# Altium schematic sheet MCU.SchDoc
size A3; SheetNumber: 7; SheetTotal: 10
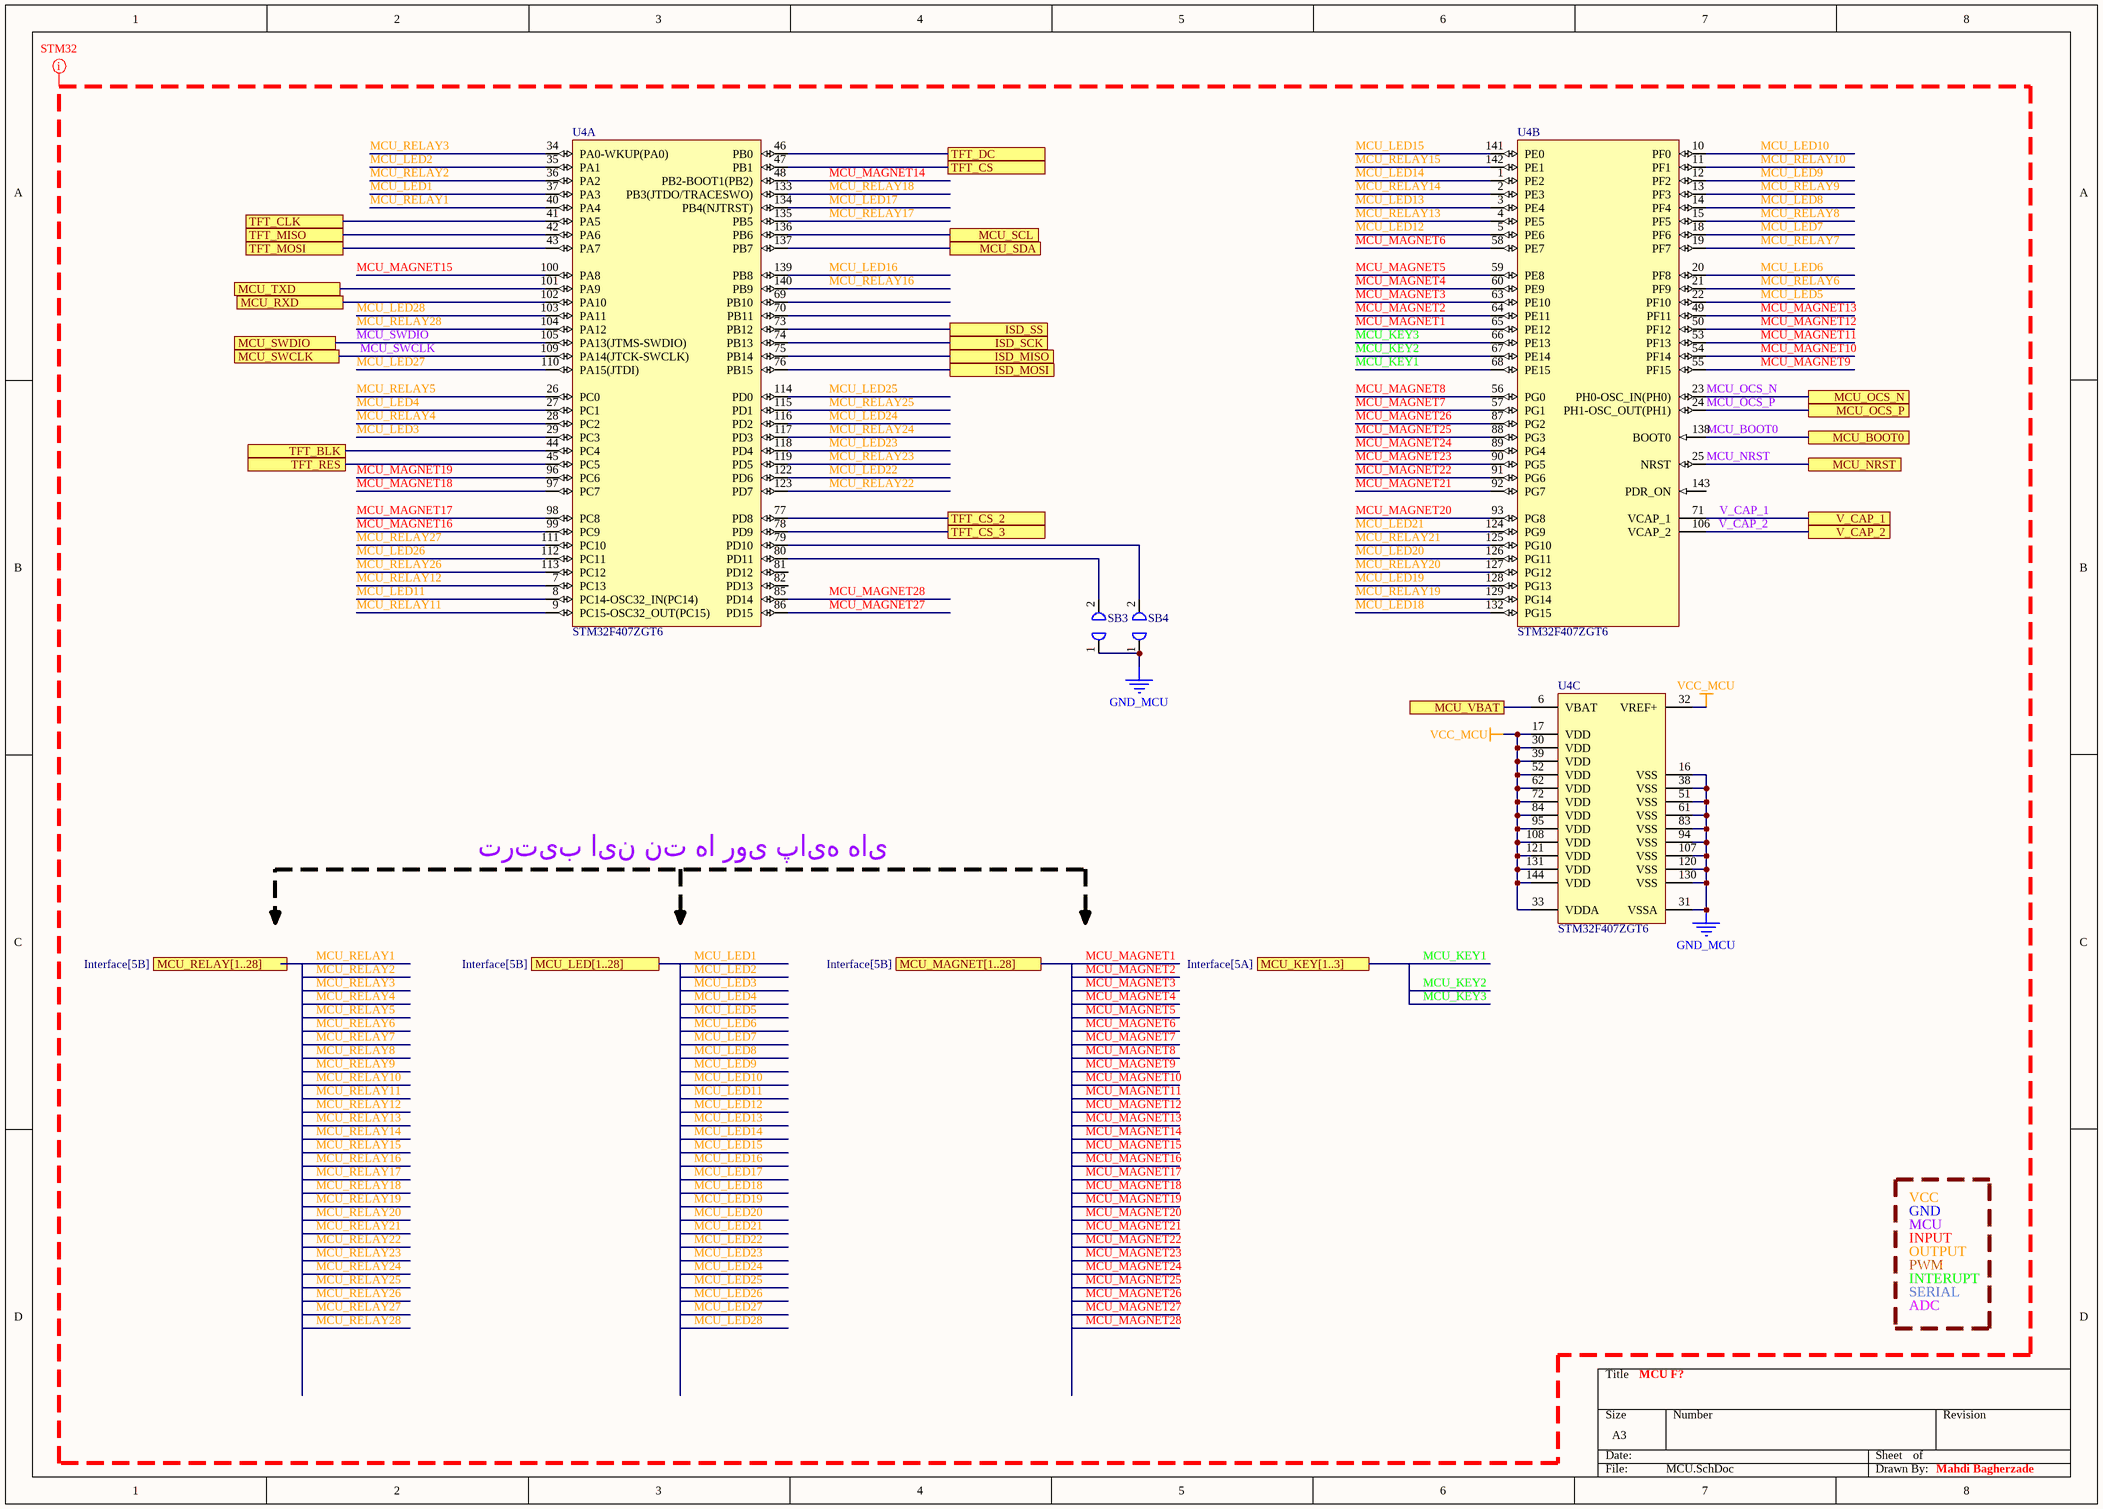
[diagram p0: MCU.SchDoc]

## Parts
SB3  SOLDER BRIDGE-2  [SB-ARC]  (value not drawn)  (net tie, no BOM)
SB4  SOLDER BRIDGE-2  [SB-ARC]  (value not drawn)  (net tie, no BOM)
U4  STM32F407ZGT6  [STM-LQFP144_M]  (parts A,B,C of 3)

## Ports
ISD_MISO (see Interface[7B], ISD1730[1B]), ISD_MOSI (see Interface[7B], ISD1730[1B]), ISD_SCK (see Interface[7B], ISD1730[1B]), ISD_SS (see Interface[7B], ISD1730[1B]), MCU_BOOT0 (see Interface[7A], STM32_AUX[1B]), MCU_KEY[1..3] (see Interface[5A]), MCU_LED[1..28] (see Interface[5B]), MCU_MAGNET[1..28] (see Interface[5B]), MCU_NRST (see Interface[7B], STM32_AUX[3A]), MCU_OCS_N (see Interface[7B], STM32_AUX[4A]), MCU_OCS_P (see Interface[7B], STM32_AUX[4A]), MCU_RELAY[1..28] (see Interface[5B]), MCU_RXD (see Interface[7A]), MCU_SCL (see Interface[5A], EEPROM[3B]), MCU_SDA (see Interface[5A], EEPROM[3B]), MCU_SWCLK (see Interface[7A], STM32_AUX[2B]), MCU_SWDIO (see Interface[7A], STM32_AUX[1B]), MCU_TXD (see Interface[7A]), MCU_VBAT (see Interface[7B], STM32_AUX[1D]), TFT_BLK (see Interface[7C], LCD TFT 40 Pin[1B]), TFT_CLK (see Interface[7B], LCD TFT 40 Pin[1A]), TFT_CS (see Interface[7B], LCD TFT 40 Pin[1A]), TFT_CS_2 (see Interface[7C], LCD TFT 40 Pin[1B]), TFT_CS_3 (see Interface[7C], LCD TFT 40 Pin[1B]), TFT_DC (see Interface[7C], LCD TFT 40 Pin[1A]), TFT_MISO (see Interface[7B], LCD TFT 40 Pin[1A]), TFT_MOSI (see Interface[7B], LCD TFT 40 Pin[1A]), TFT_RES (see Interface[7C], LCD TFT 40 Pin[1B]), V_CAP_1 (see Interface[7B], STM32_AUX[3C]), V_CAP_2 (see Interface[7B], STM32_AUX[3C])

## Nets
GND_MCU: SB3.1 SB4.1 U4.16(VSS) U4.31(VSSA) U4.38(VSS) U4.51(VSS) U4.61(VSS) U4.83(VSS) U4.94(VSS) U4.107(VSS) U4.120(VSS) U4.130(VSS)
VCC_MCU: U4.17(VDD) U4.30(VDD) U4.32(VREF+) U4.33(VDDA) U4.39(VDD) U4.52(VDD) U4.62(VDD) U4.72(VDD) U4.84(VDD) U4.95(VDD) U4.108(VDD) U4.121(VDD) U4.131(VDD) U4.144(VDD)
ISD_MISO: U4.75(PB14) ; port ISD_MISO
ISD_MOSI: U4.76(PB15) ; port ISD_MOSI
ISD_SCK: U4.74(PB13) ; port ISD_SCK
ISD_SS: U4.73(PB12) ; port ISD_SS
MCU_BOOT0: U4.138(BOOT0) ; port MCU_BOOT0
MCU_KEY1: U4.68(PE15)
MCU_KEY2: U4.67(PE14)
MCU_KEY3: U4.66(PE13)
MCU_LED1: U4.37(PA3)
MCU_LED2: U4.35(PA1)
MCU_LED3: U4.29(PC3)
MCU_LED4: U4.27(PC1)
MCU_LED5: U4.22(PF10)
MCU_LED6: U4.20(PF8)
MCU_LED7: U4.18(PF6)
MCU_LED8: U4.14(PF4)
MCU_LED9: U4.12(PF2)
MCU_LED10: U4.10(PF0)
MCU_LED11: U4.8(PC14-OSC32_IN(PC14))
MCU_LED12: U4.5(PE6)
MCU_LED13: U4.3(PE4)
MCU_LED14: U4.1(PE2)
MCU_LED15: U4.141(PE0)
MCU_LED16: U4.139(PB8)
MCU_LED17: U4.134(PB4(NJTRST))
MCU_LED18: U4.132(PG15)
MCU_LED19: U4.128(PG13)
MCU_LED20: U4.126(PG11)
MCU_LED21: U4.124(PG9)
MCU_LED22: U4.122(PD6)
MCU_LED23: U4.118(PD4)
MCU_LED24: U4.116(PD2)
MCU_LED25: U4.114(PD0)
MCU_LED26: U4.112(PC11)
MCU_LED27: U4.110(PA15(JTDI))
MCU_LED28: U4.103(PA11)
MCU_MAGNET1: U4.65(PE12)
MCU_MAGNET2: U4.64(PE11)
MCU_MAGNET3: U4.63(PE10)
MCU_MAGNET4: U4.60(PE9)
MCU_MAGNET5: U4.59(PE8)
MCU_MAGNET6: U4.58(PE7)
MCU_MAGNET7: U4.57(PG1)
MCU_MAGNET8: U4.56(PG0)
MCU_MAGNET9: U4.55(PF15)
MCU_MAGNET10: U4.54(PF14)
MCU_MAGNET11: U4.53(PF13)
MCU_MAGNET12: U4.50(PF12)
MCU_MAGNET13: U4.49(PF11)
MCU_MAGNET14: U4.48(PB2-BOOT1(PB2))
MCU_MAGNET15: U4.100(PA8)
MCU_MAGNET16: U4.99(PC9)
MCU_MAGNET17: U4.98(PC8)
MCU_MAGNET18: U4.97(PC7)
MCU_MAGNET19: U4.96(PC6)
MCU_MAGNET20: U4.93(PG8)
MCU_MAGNET21: U4.92(PG7)
MCU_MAGNET22: U4.91(PG6)
MCU_MAGNET23: U4.90(PG5)
MCU_MAGNET24: U4.89(PG4)
MCU_MAGNET25: U4.88(PG3)
MCU_MAGNET26: U4.87(PG2)
MCU_MAGNET27: U4.86(PD15)
MCU_MAGNET28: U4.85(PD14)
MCU_NRST: U4.25(NRST) ; port MCU_NRST
MCU_OCS_N: U4.23(PH0-OSC_IN(PH0)) ; port MCU_OCS_N
MCU_OCS_P: U4.24(PH1-OSC_OUT(PH1)) ; port MCU_OCS_P
MCU_RELAY1: U4.40(PA4)
MCU_RELAY2: U4.36(PA2)
MCU_RELAY3: U4.34(PA0-WKUP(PA0))
MCU_RELAY4: U4.28(PC2)
MCU_RELAY5: U4.26(PC0)
MCU_RELAY6: U4.21(PF9)
MCU_RELAY7: U4.19(PF7)
MCU_RELAY8: U4.15(PF5)
MCU_RELAY9: U4.13(PF3)
MCU_RELAY10: U4.11(PF1)
MCU_RELAY11: U4.9(PC15-OSC32_OUT(PC15))
MCU_RELAY12: U4.7(PC13)
MCU_RELAY13: U4.4(PE5)
MCU_RELAY14: U4.2(PE3)
MCU_RELAY15: U4.142(PE1)
MCU_RELAY16: U4.140(PB9)
MCU_RELAY17: U4.135(PB5)
MCU_RELAY18: U4.133(PB3(JTDO/TRACESWO))
MCU_RELAY19: U4.129(PG14)
MCU_RELAY20: U4.127(PG12)
MCU_RELAY21: U4.125(PG10)
MCU_RELAY22: U4.123(PD7)
MCU_RELAY23: U4.119(PD5)
MCU_RELAY24: U4.117(PD3)
MCU_RELAY25: U4.115(PD1)
MCU_RELAY26: U4.113(PC12)
MCU_RELAY27: U4.111(PC10)
MCU_RELAY28: U4.104(PA12)
MCU_RXD: U4.102(PA10) ; port MCU_RXD
MCU_SCL: U4.136(PB6) ; port MCU_SCL
MCU_SDA: U4.137(PB7) ; port MCU_SDA
MCU_SWCLK: U4.109(PA14(JTCK-SWCLK)) ; port MCU_SWCLK
MCU_SWDIO: U4.105(PA13(JTMS-SWDIO)) ; port MCU_SWDIO
MCU_TXD: U4.101(PA9) ; port MCU_TXD
MCU_VBAT: U4.6(VBAT) ; port MCU_VBAT
TFT_BLK: U4.44(PC4) ; port TFT_BLK
TFT_CLK: U4.41(PA5) ; port TFT_CLK
TFT_CS: U4.47(PB1) ; port TFT_CS
TFT_CS_2: U4.77(PD8) ; port TFT_CS_2
TFT_CS_3: U4.78(PD9) ; port TFT_CS_3
TFT_DC: U4.46(PB0) ; port TFT_DC
TFT_MISO: U4.42(PA6) ; port TFT_MISO
TFT_MOSI: U4.43(PA7) ; port TFT_MOSI
TFT_RES: U4.45(PC5) ; port TFT_RES
V_CAP_1: U4.71(VCAP_1) ; port V_CAP_1
V_CAP_2: U4.106(VCAP_2) ; port V_CAP_2
NetSB3_2: SB3.2 U4.80(PD11)
NetSB4_2: SB4.2 U4.79(PD10)

Not connected (* = marked no-connect by the designer): U4 69(PB10) 70(PB11) 81(PD12) 82(PD13) 143(PDR_ON)

## Layout directives
net class STM32: GND_MCU, MCU_BOOT0, MCU_KEY1, MCU_KEY2, MCU_KEY3, MCU_LED1, MCU_LED2, MCU_LED3, MCU_LED4, MCU_LED5, MCU_LED6, MCU_LED7, MCU_LED8, MCU_LED9, MCU_LED10, MCU_LED11, MCU_LED12, MCU_LED13, MCU_LED14, MCU_LED15, MCU_LED16, MCU_LED17, MCU_LED18, MCU_LED19, MCU_LED20, MCU_LED21, MCU_LED22, MCU_LED23, MCU_LED24, MCU_LED25, MCU_LED26, MCU_LED27, MCU_LED28, MCU_MAGNET1, MCU_MAGNET2, MCU_MAGNET3, MCU_MAGNET4, MCU_MAGNET5, MCU_MAGNET6, MCU_MAGNET7, MCU_MAGNET8, MCU_MAGNET9, MCU_MAGNET10, MCU_MAGNET11, MCU_MAGNET12, MCU_MAGNET13, MCU_MAGNET14, MCU_MAGNET15, MCU_MAGNET16, MCU_MAGNET17, MCU_MAGNET18, MCU_MAGNET19, MCU_MAGNET20, MCU_MAGNET21, MCU_MAGNET22, MCU_MAGNET23, MCU_MAGNET24, MCU_MAGNET25, MCU_MAGNET26, MCU_MAGNET27, MCU_MAGNET28, MCU_NRST, MCU_OCS_N, MCU_OCS_P, MCU_RELAY1, MCU_RELAY2, MCU_RELAY3, MCU_RELAY4, MCU_RELAY5, MCU_RELAY6, MCU_RELAY7, MCU_RELAY8, MCU_RELAY9, MCU_RELAY10, MCU_RELAY11, MCU_RELAY12, MCU_RELAY13, MCU_RELAY14, MCU_RELAY15, MCU_RELAY16, MCU_RELAY17, MCU_RELAY18, MCU_RELAY19, MCU_RELAY20, MCU_RELAY21, MCU_RELAY22, MCU_RELAY23, MCU_RELAY24, MCU_RELAY25, MCU_RELAY26, MCU_RELAY27, MCU_RELAY28, MCU_SWCLK, MCU_SWDIO, V_CAP_1, V_CAP_2, VCC_MCU

## Notes on the sheet
- ترتیب این نت ها روی پایه های میکرو میتوانند با هم تعویض شوند
- INPUT
- OUTPUT
- MCU
- GND
- VCC
- INTERUPT
- SERIAL
- ADC
- PWM
- MCU F?
- Mahdi Bagherzade

## Library data of the parts
SB3 SB4 = SOLDER BRIDGE-2: Phone Number: 0915 8700 314; Publisher: Mahdi Bagherzadeh; ComponentLink1Description: Linkedin; ComponentLink1URL: https://ir.linkedin.com/in/mahdi-bagherzade; Published Date: 9-15-2024
U4 = STM32F407ZGT6: ARM Cortex-M4 32-bit MCU+FPU, 210 DMIPS, 1024 kB Flash, 192 kB Internal RAM, 114 I/Os, 144-pin LQFP, -40 to 85 degC, Tray; Manufacturer: STMicroelectronics; D/A Converter: 2x12-bit; FLASH Size (Prog) (kB): 1024; I/Os (High Current): 114; Internal RAM Size (kB): 192; Operating Frequency(F) (Processor speed) (MHz): 168; Supply Voltage(Vcc) max (V): 3.6; Supply Voltage(Vcc) min (V): 1.8; DatasheetVersion: Rev. 4; PackageVersion: Rev. 4, 06/2013; PackageReference: LQFP144; PackageDescription: 144-Pin Low Profile Quad Flat Package, 20 x 20 mm Body, 0.5 mm Pitch; Supplier 1: Digi-Key; Supplier Part Number 1: 497-11766-ND; Supplier 2: Newark; Supplier Part Number 2: 73T2334; Supplier 3: Mouser; Supplier Part Number 3: 511-STM32F407ZGT6; Core: ARM Cortex-M4; Packing: Tray; Mounting Technology: Surface Mount; PartNumber: STM32F407ZGT6; ComponentLink1Description: Manufacturer URL; ComponentLink1URL: http://www.st.com/web/en/home.html; ComponentLink2Description: Datasheet; ComponentLink2URL: http://www.st.com/st-web-ui/static/active/en/resource/technical/document/datasheet/DM00037051.pdf; ComponentLink3Description: Package Specification; ComponentLink3URL: http://www.st.com/st-web-ui/static/active/en/resource/technical/document/datasheet/DM00037051.pdf